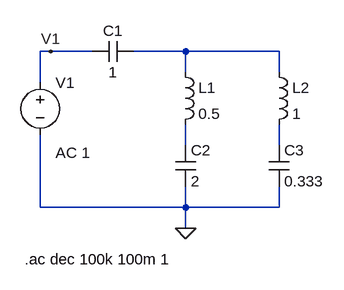
[diagram p0: schematic remParcial.asc]
remParcial.asc, the LTspice schematic file:
Version 4
SHEET 1 880 680
WIRE 0 48 -16 48
WIRE 64 48 0 48
WIRE 208 48 128 48
WIRE 352 48 208 48
WIRE 208 80 208 48
WIRE 352 80 352 48
WIRE -16 96 -16 48
WIRE 208 192 208 160
WIRE 352 192 352 160
WIRE -16 288 -16 176
WIRE 208 288 208 256
WIRE 208 288 -16 288
WIRE 352 288 352 256
WIRE 352 288 208 288
WIRE 208 320 208 288
FLAG 208 320 0
FLAG 0 48 V1
SYMBOL voltage -16 80 R0
WINDOW 123 24 124 Left 2
WINDOW 39 0 0 Left 0
SYMATTR InstName V1
SYMATTR Value ""
SYMATTR Value2 AC 1
SYMBOL cap 128 32 R90
WINDOW 0 0 32 VBottom 2
WINDOW 3 32 32 VTop 2
SYMATTR InstName C1
SYMATTR Value 1
SYMBOL ind 192 64 R0
SYMATTR InstName L1
SYMATTR Value 0.5
SYMBOL ind 336 64 R0
SYMATTR InstName L2
SYMATTR Value 1
SYMBOL cap 192 192 R0
SYMATTR InstName C2
SYMATTR Value 2
SYMBOL cap 336 192 R0
SYMATTR InstName C3
SYMATTR Value 0.333
TEXT -40 368 Left 2 !.ac dec 100k 100m 1

The netlist it stands for:
* remParcial.asc
V1 V1 0 AC 1
C1 N001 V1 1
L1 N001 N002 0.5
L2 N001 N003 1
C2 N002 0 2
C3 N003 0 0.333
.ac dec 100k 100m 1
.backanno
.end